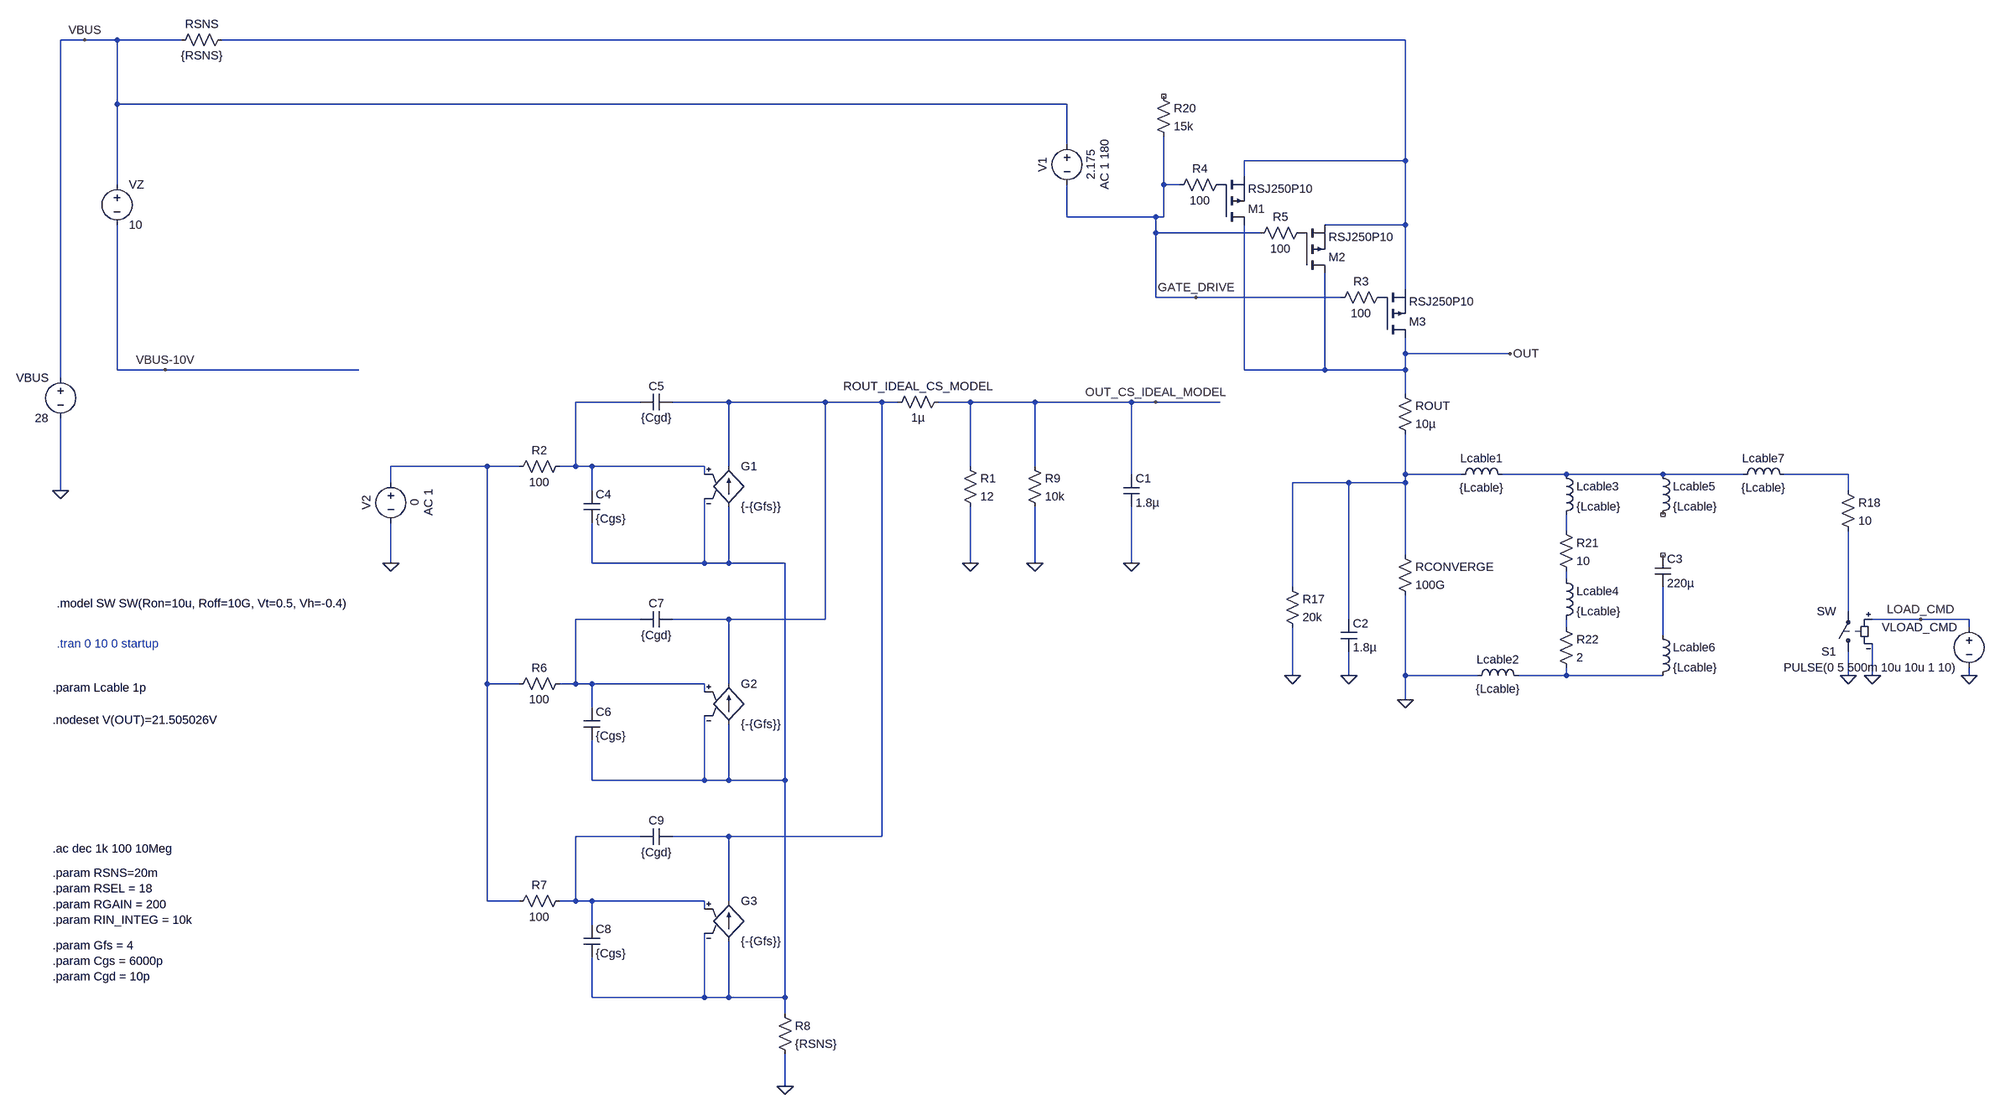
[diagram p0: schematic PMOS_COMMON_SOURCE_TEST.asc]
PMOS_COMMON_SOURCE_TEST.asc, the LTspice schematic file:
Version 4
SHEET 1 2276 1988
WIRE -1568 -208 -1616 -208
WIRE -1504 -208 -1568 -208
WIRE -1376 -208 -1504 -208
WIRE 1072 -208 -1296 -208
WIRE -1504 -80 -1504 -208
WIRE 400 -80 -1504 -80
WIRE 400 0 400 -80
WIRE 1072 32 1072 -208
WIRE 1072 32 752 32
WIRE 752 64 752 32
WIRE -1504 80 -1504 -80
WIRE 592 80 592 -16
WIRE 624 80 592 80
WIRE 400 144 400 80
WIRE 576 144 400 144
WIRE 592 144 592 80
WIRE 592 144 576 144
WIRE 1072 160 1072 32
WIRE 1072 160 912 160
WIRE 576 176 576 144
WIRE 784 176 576 176
WIRE 1072 288 1072 160
WIRE 576 304 576 176
WIRE 656 304 576 304
WIRE 944 304 656 304
WIRE 1072 416 1072 384
WIRE 1280 416 1072 416
WIRE -1504 448 -1504 160
WIRE -1408 448 -1504 448
WIRE -1024 448 -1408 448
WIRE 752 448 752 160
WIRE 912 448 912 256
WIRE 912 448 752 448
WIRE 1072 448 1072 416
WIRE 1072 448 912 448
WIRE -1616 464 -1616 -208
WIRE 1072 496 1072 448
WIRE -448 512 -576 512
WIRE -272 512 -384 512
WIRE -80 512 -272 512
WIRE 32 512 -80 512
WIRE 64 512 32 512
WIRE 208 512 144 512
WIRE 336 512 208 512
WIRE 528 512 336 512
WIRE 576 512 528 512
WIRE 704 512 576 512
WIRE -752 640 -960 640
WIRE -688 640 -752 640
WIRE -576 640 -576 512
WIRE -576 640 -608 640
WIRE -544 640 -576 640
WIRE -320 640 -544 640
WIRE -272 640 -272 512
WIRE 208 640 208 512
WIRE 336 640 336 512
WIRE -320 656 -320 640
WIRE 528 656 528 512
WIRE 1072 656 1072 576
WIRE 1184 656 1072 656
WIRE 1392 656 1264 656
WIRE 1584 656 1392 656
WIRE 1744 656 1584 656
WIRE 1952 656 1824 656
WIRE -960 672 -960 640
WIRE 960 672 848 672
WIRE 1072 672 1072 656
WIRE 1072 672 960 672
WIRE -1616 688 -1616 544
WIRE -544 688 -544 640
WIRE 1952 688 1952 656
WIRE 1392 768 1392 736
WIRE 1072 816 1072 672
WIRE -960 832 -960 752
WIRE -544 832 -544 752
WIRE -320 832 -320 704
WIRE -320 832 -544 832
WIRE -272 832 -272 720
WIRE -272 832 -320 832
WIRE -160 832 -272 832
WIRE 208 832 208 720
WIRE 336 832 336 720
WIRE 528 832 528 720
WIRE 1392 864 1392 848
WIRE 848 880 848 672
WIRE 1952 928 1952 768
WIRE -448 944 -576 944
WIRE -272 944 -384 944
WIRE -80 944 -80 512
WIRE -80 944 -272 944
WIRE 960 944 960 672
WIRE 2096 944 2000 944
WIRE 2192 944 2096 944
WIRE 1392 960 1392 944
WIRE 2192 960 2192 944
WIRE 1584 976 1584 880
WIRE 848 1056 848 960
WIRE 960 1056 960 1008
WIRE 1072 1056 1072 896
WIRE 1216 1056 1072 1056
WIRE 1392 1056 1392 1040
WIRE 1392 1056 1296 1056
WIRE 1584 1056 1392 1056
WIRE 1952 1056 1952 1008
WIRE 2000 1056 2000 992
WIRE 2192 1056 2192 1040
WIRE -752 1072 -752 640
WIRE -688 1072 -752 1072
WIRE -576 1072 -576 944
WIRE -576 1072 -608 1072
WIRE -544 1072 -576 1072
WIRE -320 1072 -544 1072
WIRE -272 1072 -272 944
WIRE -320 1088 -320 1072
WIRE 1072 1104 1072 1056
WIRE -544 1120 -544 1072
WIRE -544 1264 -544 1184
WIRE -320 1264 -320 1136
WIRE -320 1264 -544 1264
WIRE -272 1264 -272 1152
WIRE -272 1264 -320 1264
WIRE -160 1264 -160 832
WIRE -160 1264 -272 1264
WIRE -448 1376 -576 1376
WIRE -272 1376 -384 1376
WIRE 32 1376 32 512
WIRE 32 1376 -272 1376
WIRE -752 1504 -752 1072
WIRE -688 1504 -752 1504
WIRE -576 1504 -576 1376
WIRE -576 1504 -608 1504
WIRE -544 1504 -576 1504
WIRE -320 1504 -544 1504
WIRE -272 1504 -272 1376
WIRE -320 1520 -320 1504
WIRE -544 1552 -544 1504
WIRE -544 1696 -544 1616
WIRE -320 1696 -320 1568
WIRE -320 1696 -544 1696
WIRE -272 1696 -272 1584
WIRE -272 1696 -320 1696
WIRE -160 1696 -160 1264
WIRE -160 1696 -272 1696
WIRE -160 1728 -160 1696
WIRE -160 1872 -160 1808
FLAG 656 304 GATE_DRIVE
FLAG -1616 688 0
FLAG -1568 -208 VBUS
FLAG 848 1056 0
FLAG 960 1056 0
FLAG 1952 1056 0
FLAG 2192 1056 0
FLAG 2000 1056 0
FLAG 2096 944 LOAD_CMD
FLAG 1072 1104 0
FLAG 1280 416 OUT
FLAG -1408 448 VBUS-10V
FLAG -960 832 0
FLAG 528 832 0
FLAG 576 512 OUT_CS_IDEAL_MODEL
FLAG 208 832 0
FLAG -160 1872 0
FLAG 336 832 0
DATAFLAG 1152 416 ""
DATAFLAG 208 -208 ""
DATAFLAG 208 -208 ""
DATAFLAG 560 144 ""
DATAFLAG -1472 -208 ""
DATAFLAG -1472 -208 ""
DATAFLAG 1104 656 ""
DATAFLAG 1104 656 ""
SYMBOL res 1040 288 R90
WINDOW 0 0 56 VBottom 2
WINDOW 3 32 56 VTop 2
SYMATTR InstName R3
SYMATTR Value 100
SYMBOL voltage 400 -16 R0
WINDOW 0 -32 56 VBottom 2
WINDOW 3 32 56 VTop 2
WINDOW 123 60 56 VTop 2
WINDOW 39 0 0 Left 0
SYMATTR InstName V1
SYMATTR Value 2.175
SYMATTR Value2 AC 1 180
SYMBOL res -1392 -192 R270
WINDOW 0 32 56 VTop 2
WINDOW 3 0 56 VBottom 2
SYMATTR InstName RSNS
SYMATTR Value {RSNS}
SYMBOL voltage -1616 448 M0
SYMATTR InstName VBUS
SYMATTR Value 28
SYMBOL voltage -1504 64 R0
WINDOW 123 0 0 Left 0
WINDOW 39 0 0 Left 0
SYMATTR InstName VZ
SYMATTR Value 10
SYMBOL res 832 864 R0
SYMATTR InstName R17
SYMATTR Value 20k
SYMBOL cap 944 944 R0
SYMATTR InstName C2
SYMATTR Value 1.8µ
SYMBOL sw 1952 1024 R180
SYMATTR InstName S1
SYMBOL voltage 2192 944 M0
WINDOW 123 0 0 Left 0
WINDOW 39 0 0 Left 0
SYMATTR InstName VLOAD_CMD
SYMATTR Value PULSE(0 5 500m 10u 10u 1 10)
SYMBOL res 1056 480 R0
SYMATTR InstName ROUT
SYMATTR Value 10µ
SYMBOL res 576 -112 R0
SYMATTR InstName R20
SYMATTR Value 15k
SYMBOL pmos 1024 384 M180
SYMATTR InstName M3
SYMATTR Value RSJ250P10
SYMBOL res 1056 800 R0
SYMATTR InstName RCONVERGE
SYMATTR Value 100G
SYMBOL ind 1168 672 R270
WINDOW 0 32 56 VTop 2
WINDOW 3 5 56 VBottom 2
SYMATTR InstName Lcable1
SYMATTR Value {Lcable}
SYMBOL ind 1200 1072 R270
WINDOW 0 32 56 VTop 2
WINDOW 3 5 56 VBottom 2
SYMATTR InstName Lcable2
SYMATTR Value {Lcable}
SYMBOL ind 1376 640 R0
SYMATTR InstName Lcable3
SYMATTR Value {Lcable}
SYMBOL res 1376 752 R0
SYMATTR InstName R21
SYMATTR Value 10
SYMBOL ind 1376 848 R0
SYMATTR InstName Lcable4
SYMATTR Value {Lcable}
SYMBOL res 1376 944 R0
SYMATTR InstName R22
SYMATTR Value 2
SYMBOL ind 1568 640 R0
SYMATTR InstName Lcable5
SYMATTR Value {Lcable}
SYMBOL ind 1568 960 R0
SYMATTR InstName Lcable6
SYMATTR Value {Lcable}
SYMBOL cap 1568 816 R0
SYMATTR InstName C3
SYMATTR Value 220µ
SYMBOL ind 1728 672 R270
WINDOW 0 32 56 VTop 2
WINDOW 3 5 56 VBottom 2
SYMATTR InstName Lcable7
SYMATTR Value {Lcable}
SYMBOL res 1936 672 R0
SYMATTR InstName R18
SYMATTR Value 10
SYMBOL g -272 624 R0
SYMATTR InstName G1
SYMATTR Value {-{Gfs}}
SYMBOL voltage -960 656 R0
WINDOW 0 -32 56 VBottom 2
WINDOW 3 32 56 VTop 2
WINDOW 123 60 56 VTop 2
WINDOW 39 0 0 Left 0
SYMATTR InstName V2
SYMATTR Value 0
SYMATTR Value2 AC 1
SYMBOL res 192 624 R0
SYMATTR InstName R1
SYMATTR Value 12
SYMBOL cap 512 656 R0
SYMATTR InstName C1
SYMATTR Value 1.8µ
SYMBOL res -592 624 R90
WINDOW 0 0 56 VBottom 2
WINDOW 3 32 56 VTop 2
SYMATTR InstName R2
SYMATTR Value 100
SYMBOL cap -560 688 R0
SYMATTR InstName C4
SYMATTR Value {Cgs}
SYMBOL cap -384 496 R90
WINDOW 0 0 32 VBottom 2
WINDOW 3 32 32 VTop 2
SYMATTR InstName C5
SYMATTR Value {Cgd}
SYMBOL res 720 64 R90
WINDOW 0 0 56 VBottom 2
WINDOW 3 32 56 VTop 2
SYMATTR InstName R4
SYMATTR Value 100
SYMBOL pmos 704 160 M180
SYMATTR InstName M1
SYMATTR Value RSJ250P10
SYMBOL res 880 160 R90
WINDOW 0 0 56 VBottom 2
WINDOW 3 32 56 VTop 2
SYMATTR InstName R5
SYMATTR Value 100
SYMBOL pmos 864 256 M180
SYMATTR InstName M2
SYMATTR Value RSJ250P10
SYMBOL g -272 1056 R0
SYMATTR InstName G2
SYMATTR Value {-{Gfs}}
SYMBOL res -592 1056 R90
WINDOW 0 0 56 VBottom 2
WINDOW 3 32 56 VTop 2
SYMATTR InstName R6
SYMATTR Value 100
SYMBOL cap -560 1120 R0
SYMATTR InstName C6
SYMATTR Value {Cgs}
SYMBOL cap -384 928 R90
WINDOW 0 0 32 VBottom 2
WINDOW 3 32 32 VTop 2
SYMATTR InstName C7
SYMATTR Value {Cgd}
SYMBOL g -272 1488 R0
SYMATTR InstName G3
SYMATTR Value {-{Gfs}}
SYMBOL res -592 1488 R90
WINDOW 0 0 56 VBottom 2
WINDOW 3 32 56 VTop 2
SYMATTR InstName R7
SYMATTR Value 100
SYMBOL cap -560 1552 R0
SYMATTR InstName C8
SYMATTR Value {Cgs}
SYMBOL cap -384 1360 R90
WINDOW 0 0 32 VBottom 2
WINDOW 3 32 32 VTop 2
SYMATTR InstName C9
SYMATTR Value {Cgd}
SYMBOL res -176 1712 R0
SYMATTR InstName R8
SYMATTR Value {RSNS}
SYMBOL res 48 528 R270
WINDOW 0 32 56 VTop 2
WINDOW 3 0 56 VBottom 2
SYMATTR InstName ROUT_IDEAL_CS_MODEL
SYMATTR Value 1µ
SYMBOL res 320 624 R0
SYMATTR InstName R9
SYMATTR Value 10k
TEXT -1632 1448 Left 2 !.param RSNS=20m\n.param RSEL = 18\n.param RGAIN = 200\n.param RIN_INTEG = 10k
TEXT -1624 912 Left 2 !.model SW SW(Ron=10u, Roff=10G, Vt=0.5, Vh=-0.4)
TEXT -1624 992 Left 2 ;.tran 0 10 0 startup
TEXT -1632 1080 Left 2 !.param Lcable 1p
TEXT -1632 1144 Left 2 !.nodeset V(OUT)=21.505026V
TEXT -1632 1400 Left 2 !.ac dec 1k 100 10Meg
TEXT -1632 1592 Left 2 !.param Gfs = 4\n.param Cgs = 6000p\n.param Cgd = 10p

The netlist it stands for:
* PMOS_COMMON_SOURCE_TEST.asc
R3 P001 GATE_DRIVE 100
V1 VBUS GATE_DRIVE 2.175 AC 1 180
RSNS VBUS N001 {RSNS}
VBUS VBUS 0 28
VZ VBUS VBUS-10V 10
R17 N005 0 20k
C2 N005 0 1.8µ
S1 0 N011 LOAD_CMD 0 SW
VLOAD_CMD LOAD_CMD 0 PULSE(0 5 500m 10u 10u 1 10)
ROUT OUT N005 10µ
R20 NC_01 GATE_DRIVE 15k
M3 OUT P001 N001 N001 RSJ250P10
RCONVERGE N005 0 100G
Lcable1 N005 N006 {Lcable}
Lcable2 0 N015 {Lcable}
Lcable3 N006 N008 {Lcable}
R21 N008 N010 10
Lcable4 N010 N013 {Lcable}
R22 N013 N015 2
Lcable5 N006 NC_02 {Lcable}
Lcable6 N014 N015 {Lcable}
C3 NC_03 N014 220µ
Lcable7 N006 N007 {Lcable}
R18 N007 N011 10
G1 N009 N003 N002 N009 {-{Gfs}}
V2 N004 0 0 AC 1
R1 OUT_CS_IDEAL_MODEL 0 12
C1 OUT_CS_IDEAL_MODEL 0 1.8µ
R2 N002 N004 100
C4 N002 N009 {Cgs}
C5 N003 N002 {Cgd}
R4 P002 GATE_DRIVE 100
M1 OUT P002 N001 N001 RSJ250P10
R5 P003 GATE_DRIVE 100
M2 OUT P003 N001 N001 RSJ250P10
G2 N009 N003 N012 N009 {-{Gfs}}
R6 N012 N004 100
C6 N012 N009 {Cgs}
C7 N003 N012 {Cgd}
G3 N009 N003 N016 N009 {-{Gfs}}
R7 N016 N004 100
C8 N016 N009 {Cgs}
C9 N003 N016 {Cgd}
R8 N009 0 {RSNS}
ROUT_IDEAL_CS_MODEL N003 OUT_CS_IDEAL_MODEL 1µ
R9 OUT_CS_IDEAL_MODEL 0 10k
.model NMOS NMOS
.model PMOS PMOS
.lib standard.mos
.param RSNS=20m
.param RSEL = 18
.param RGAIN = 200
.param RIN_INTEG = 10k
.model SW SW(Ron=10u, Roff=10G, Vt=0.5, Vh=-0.4)
* .tran 0 10 0 startup
.param Lcable 1p
.nodeset V(OUT)=21.505026V
.ac dec 1k 100 10Meg
.param Gfs = 4
.param Cgs = 6000p
.param Cgd = 10p
.backanno
.end